# Altium schematic sheet Schematic.SchDoc: Gramo PreAmp
size A4; DrawnBy: M6R3K; Revision: 1A; SheetNumber: 1; SheetTotal: 1
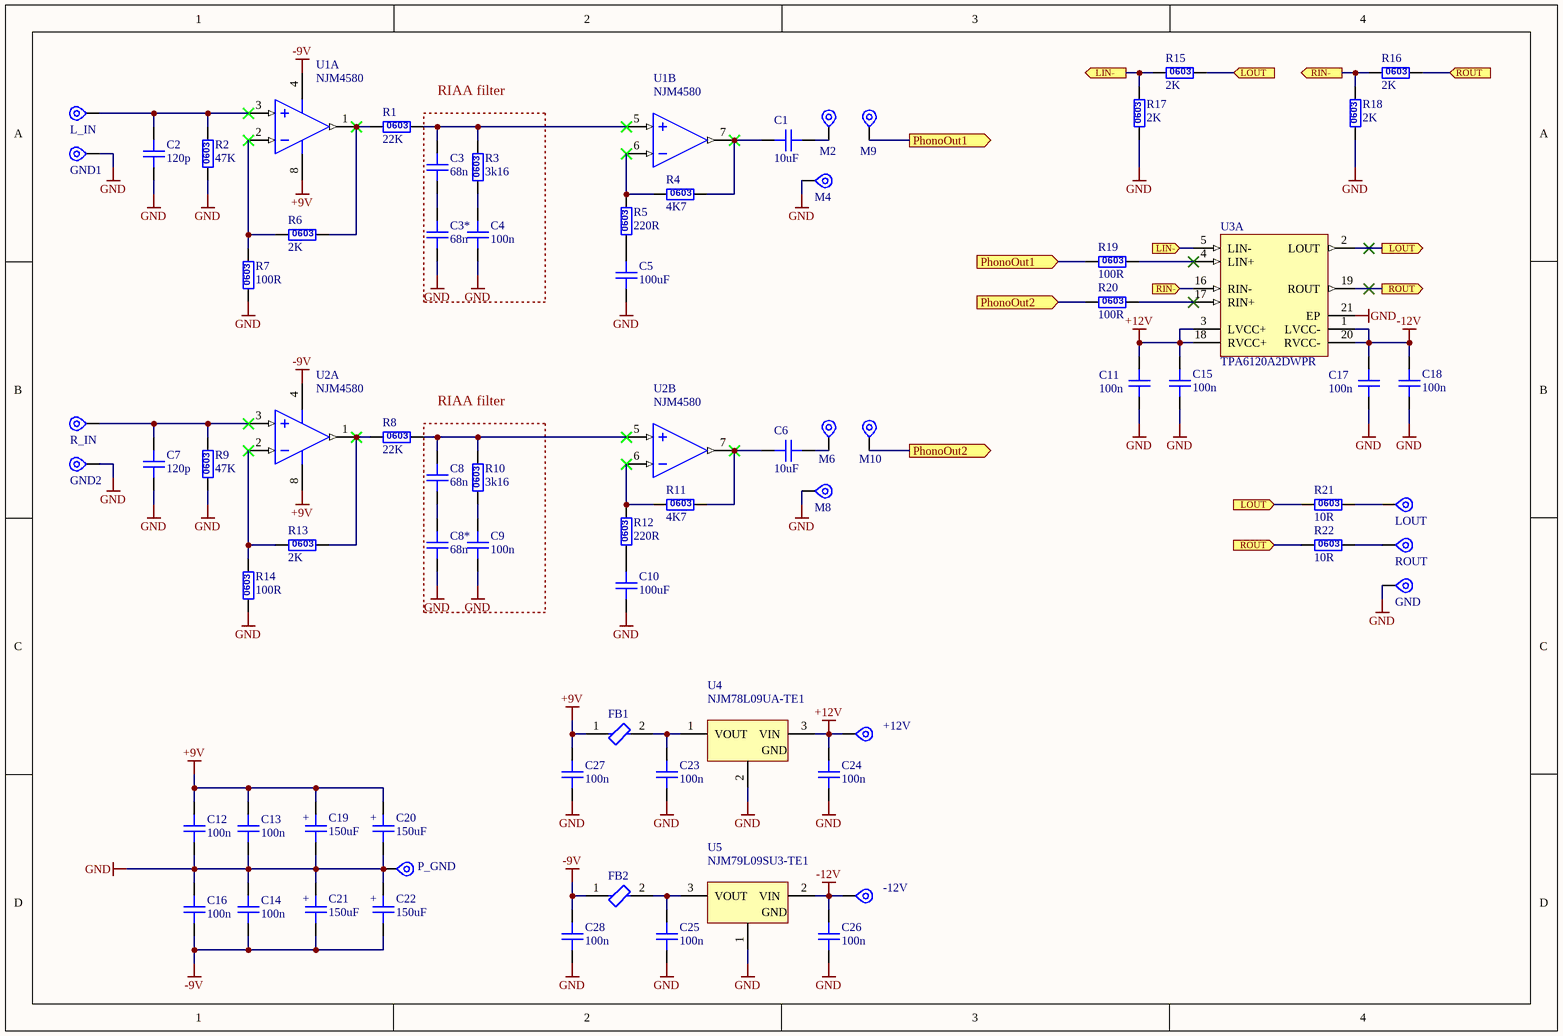
[diagram p0: Schematic.SchDoc]

## Parts
+12V  TP  [Pad 1mm MPoint big]  (value not drawn)  (no BOM)
-12V  TP  [Pad 1mm MPoint big]  (value not drawn)  (no BOM)
C1  10uF  [UES1V]
C2  120p  [C0603]
C3  68n  [VISHAY_MKP]
C3*  68n  [VISHAY_MKP]
C4  100n  [WIMA_MKS_2]
C5  100uF  [UES1E]
C6  10uF  [UES1V]
C7  120p  [C0603]
C8  68n  [VISHAY_MKP]
C8*  68n  [VISHAY_MKP]
C9  100n  [WIMA_MKS_2]
C10  100uF  [UES1E]
C11  100n  [C0603]
C12  100n  [C0603]
C13  100n  [C0603]
C14  100n  [C0603]
C15  100n  [C0603]
C16  100n  [C0603]
C17  100n  [C0603]
C18  100n  [C0603]
C19  150uF  [PZF8x9]
C20  150uF  [PZF8x9]
C21  150uF  [PZF8x9]
C22  150uF  [PZF8x9]
C23  100n  [C0603]
C24  100n  [C0603]
C25  100n  [C0603]
C26  100n  [C0603]
C27  100n  [C0603]
C28  100n  [C0603]
FB1  BLM21AG121SN1D  [FP-BLM21-0_2-t0_85-e0_5-IPC_A]  (value not drawn)
FB2  BLM21AG121SN1D  [FP-BLM21-0_2-t0_85-e0_5-IPC_A]  (value not drawn)
GND  TP  [Pad0.6mm MPoint big]  (value not drawn)  (no BOM)
GND1  TP  [Pad 1mm MPoint big]  (value not drawn)  (no BOM)
GND2  TP  [Pad 1mm MPoint big]  (value not drawn)  (no BOM)
L_IN  TP  [Pad 1mm MPoint big]  (value not drawn)  (no BOM)
LOUT  TP  [Pad0.6mm MPoint big]  (value not drawn)  (no BOM)
M2  TP  [Pad0.6mm MPoint big]  (value not drawn)  (no BOM)
M4  TP  [Pad0.6mm MPoint big]  (value not drawn)  (no BOM)
M6  TP  [Pad0.6mm MPoint big]  (value not drawn)  (no BOM)
M8  TP  [Pad0.6mm MPoint big]  (value not drawn)  (no BOM)
M9  TP  [Pad0.6mm MPoint big]  (value not drawn)  (no BOM)
M10  TP  [Pad0.6mm MPoint big]  (value not drawn)  (no BOM)
P_GND  TP  [Pad 1mm MPoint big]  (value not drawn)  (no BOM)
R1  22K  [R0603]
R2  47K  [R0603]
R3  3k16  [R0603]
R4  4K7  [R0603]
R5  220R  [R0603]
R6  2K  [R0603]
R7  100R  [R0603]
R8  22K  [R0603]
R9  47K  [R0603]
R10  3k16  [R0603]
R11  4K7  [R0603]
R12  220R  [R0603]
R13  2K  [R0603]
R14  100R  [R0603]
R15  2K  [R0603]
R16  2K  [R0603]
R17  2K  [R0603]
R18  2K  [R0603]
R19  100R  [R0603]
R20  100R  [R0603]
R21  10R  [R0603]
R22  10R  [R0603]
R_IN  TP  [Pad 1mm MPoint big]  (value not drawn)  (no BOM)
ROUT  TP  [Pad0.6mm MPoint big]  (value not drawn)  (no BOM)
U1  NJM4580  [PDIP300-P8]  (parts A,B of 2)
U2  NJM4580  [PDIP300-P8]  (parts A,B of 2)
U3  TPA6120A2DWPR  [DWP0020B_N]  (part A of 2)
U4  NJM78L09UA-TE1  [SOT-89_N]
U5  NJM79L09SU3-TE1  [SOT-89_N]

## Blocks framed on the sheet
RIAA filter: C3 C3* C4 R3
RIAA filter: C8 C8* C9 R10

## Ports
LIN- (in), LIN- (out), LOUT (in), LOUT (out), PhonoOut1 (in), PhonoOut1 (out), PhonoOut2 (in), PhonoOut2 (out), RIN- (in), RIN- (out), ROUT (in), ROUT (out)

## Nets
+9V: C12.1 C13.1 C19.1 C20.1 C27.1 FB1.1 U1.8(VDD) U2.8(VDD)
+12V: +12V.1 C11.1 C15.1 C24.1 U3.3(LVCC+) U3.18(RVCC+) U4.3(VIN)
-9V: C14.2 C16.2 C21.2 C22.2 C28.1 FB2.1 U1.4(VSS) U2.4(VSS)
-12V: -12V.1 C17.1 C18.1 C26.1 U3.1(LVCC-) U3.20(RVCC-) U5.2(VIN)
GND: C2.2 C3*.2 C4.2 C5.2 C7.2 C8*.2 C9.2 C10.2 C11.2 C12.2 C13.2 C14.1 C15.2 C16.1 C17.2 C18.2 C19.2 C20.2 C21.1 C22.1 C23.2 C24.2 C25.2 C26.2 C27.2 C28.2 GND.1 GND1.1 GND2.1 M4.1 M8.1 P_GND.1 R2.2 R7.2 R9.2 R14.2 R17.2 R18.2 U3.21(EP) U4.2(GND) U5.1(GND)
LIN-: R15.2 R17.1 U3.5(LIN-) ; port LIN-
LOUT: R15.1 R21.2 U3.2(LOUT) ; port LOUT
PhonoOut1: M9.1 R19.2 ; port PhonoOut1
PhonoOut2: M10.1 R20.2 ; port PhonoOut2
RIN-: R16.2 R18.1 U3.16(RIN-) ; port RIN-
ROUT: R16.1 R22.2 U3.19(ROUT) ; port ROUT
NetC1_1: C1.1 R4.1 U1.7(VOUT2)
NetC1_2: C1.2 M2.1
NetC2_1: C2.1 L_IN.1 R2.1 U1.3(VIN+)
NetC3_1: C3.1 R1.1 R3.1 U1.5(VIN+2)
NetC3_2: C3.2 C3*.1
NetC4_1: C4.1 R3.2
NetC5_1: C5.1 R5.2
NetC6_1: C6.1 R11.1 U2.7(VOUT2)
NetC6_2: C6.2 M6.1
NetC7_1: C7.1 R9.1 R_IN.1 U2.3(VIN+)
NetC8_1: C8.1 R8.1 R10.1 U2.5(VIN+2)
NetC8_2: C8.2 C8*.1
NetC9_1: C9.1 R10.2
NetC10_1: C10.1 R12.2
NetC23_1: C23.1 FB1.2 U4.1(VOUT)
NetC25_1: C25.1 FB2.2 U5.3(VOUT)
NetLOUT_1: LOUT.1 R21.1
NetR1_2: R1.2 R6.1 U1.1(VOUT)
NetR4_2: R4.2 R5.1 U1.6(VIN-2)
NetR6_2: R6.2 R7.1 U1.2(VIN-)
NetR8_2: R8.2 R13.1 U2.1(VOUT)
NetR11_2: R11.2 R12.1 U2.6(VIN-2)
NetR13_2: R13.2 R14.1 U2.2(VIN-)
NetR19_1: R19.1 U3.4(LIN+)
NetR20_1: R20.1 U3.17(RIN+)
NetR22_1: R22.1 ROUT.1

## Notes on the sheet
- (in symbol CR_0603_3K16) 0603
- (in symbol CR_0603_100) 0603
- (in symbol CR_0603_101) 0603
- (in symbol CR_0603_202) 0603
- (in symbol CR_0603_221) 0603
- (in symbol CR_0603_223) 0603
- (in symbol CR_0603_472) 0603
- (in symbol CR_0603_473) 0603
- (in symbol EC_THT_157_polarised) +

## Library data of the parts
+12V -12V GND GND1 GND2 L_IN LOUT M2 M4 M6 M8-M10 P_GND R_IN ROUT = TP_PCB: Test Point; Main: Mechanical; Category: Pads_Pins_Measure_Points; Stock number: --------; Component Type: Mechanical
C1 C6 = EC_THT_106_bipolar: MUSE bipolar capacitor; SMD/THD: THT; Value: 10uF/35V; Main: Capacitors; Category: Capacitors THT; Status: A; Component Type: Capacitors; Supplier 1: Mouser; Supplier 2: Digi-Key; Supplier Part Number 2: 493-10846-1-ND; Supplier Part Number 1: 647-UES1V100MEM1TD
C2 C7 = CC_0603_NP0_121: Ceramic Capacitor NP0; SMD/THD: SMD; Main: Capacitors; Category: Capacitors CERA SMD; Status: A; Value: 120p; ComponentLink1Description: datasheet; Component Type: Capacitors; Supplier 1: Mouser; Supplier 2: Farnell; Supplier Part Number 2: 2581047; Supplier Part Number 1: 80-C0603C121F5G
C3 C3* C8 C8* = FC_THT_683_1%: Foil Capacitor Vishay MKP; SMD/THD: THD; Main: Capacitors; Category: Capacitors THT; Status: A; ComponentLink1Description: datasheet; Component Type: Capacitors; Value: 68n; Supplier 1: Mouser; Supplier 2: Farnell; Supplier Part Number 2: 2528262; Supplier Part Number 1: 75-MKP1837368011
C4 C9 = FC_THT_104: Foil Capacitor WIMA MKS 2; SMD/THD: THD; Main: Capacitors; Category: Capacitors THT; Status: A; ComponentLink1Description: datasheet; Component Type: Capacitors; Supplier 1: Mouser; Supplier Part Number 1: 505-MKS2C031001AJI00; Value: 100n
C5 C10 = EC_THT_107_bipolar: MUSE bipolar capacitor; SMD/THD: THT; Value: 100uF/25V; Main: Capacitors; Category: Capacitors THT; Status: A; Component Type: Capacitors; Supplier 1: Mouser; Supplier 2: Digi-Key; Supplier Part Number 1: 647-UES1E101MPM; Supplier Part Number 2: 493-15025-ND
C11-C18 C23-C28 = CC_0603_X7R_104: Ceramic Capacitor X7R; Part Number: 100n/50V X7R C0603; SMD/THD: SMD; Main: Capacitors; Status: A; Value: 100n; Category: Capacitors CERA SMD; Manufacturer Part Number: 100n/50V X7R C0603; Component Type: Capacitors; Supplier 1: Mouser; Supplier 2: Farnell; Supplier Part Number 1: 581-06035C104K4Z2A; Supplier Part Number 2: 1833843
C19-C22 = EC_THT_157_polarised: High temp hybrid capacitor -55/125C; SMD/THD: THT; Value: 150uF/35V; Main: Capacitors; Category: Capacitors THT; Status: A; Component Type: Capacitors; Supplier 1: Mouser; Supplier 2: Digi-Key; Supplier Part Number 2: 35PZE150M8X9-ND; Supplier Part Number 1: 232-35PZE150M8X9
FB1 FB2 = CMP-0686-00716-3: FERRITE BEAD 120 OHM 0805 1LN; Number of Lines: 1; DC Resistance-Max: 100mR; Material: Steel; Max DC Current: 200mA; Shielding: Unshielded; Test Frequency: 100MHz; Impedance: 120R; Current Rating: 800mA; Max Current Rating: 1A; Resistance: 150mR; Tolerance: 25%; Width: 1.25mm; Number of Circuits: 1; Military Standard: Not; Height: 0.85mm; Series: BLM21A; Min Operating Temperature: -55°C; DC Resistance (DCR): 100mR; Termination: SMD/SMT; Core Material: Ferrite; REACH SVHC: No SVHC; Radiation Hardening: No; Max Operating Temperature: 125°C; Number of Pins: 2; Case/Package: 0805; Case Code (Imperial): 0805; Frequency: 100MHz; Depth: 1.25mm; Length: 2mm; DC Current: 200mA; Lead Free: Lead Free; Case Code (Metric): 2012; Package Quantity: 1; Packaging: Tape and Reel
R1 R8 = CR_0603_223: Resistor 1%, 0.1W, 75V; Part Number: 22K R0603; Manufacturer: Vishay; SMD/THD: SMD; Main: Resistors; Status: A; Category: Resistors SMD; Component Type: Resistors; Supplier 1: TME; Supplier 2: Farnell; Supplier 3: Digi-Key; Value: 22K; Supplier Part Number 1: RC0603JR-0722K; Supplier Part Number 2: 9233547; Supplier Part Number 3: 311-22KGRCT-ND
R2 R9 = CR_0603_473: Resistor 1%, 0.1W, 75V; SMD/THD: SMD; Main: Resistors; Status: A; Category: Resistors SMD; Component Type: Resistors; Supplier 1: Mouser; Supplier 2: Digi-Key; Supplier Part Number 2: YAG2129CT-ND; Supplier Part Number 1: 603-AT0603FRE0747KL; Value: 47K
R3 R10 = CR_0603_3K16: Resistor 1%, 0.1W, 75V; SMD/THD: SMD; Main: Resistors; Status: A; Category: Resistors SMD; Component Type: Resistors; Supplier 1: Mouser; Supplier 2: Digi-Key; Supplier Part Number 2: P20027CT-ND; Supplier Part Number 1: 667-ERJ-PB3B3161V; Value: 3k16
R4 R11 = CR_0603_472: Resistor 1%, 0.1W, 75V; SMD/THD: SMD; Main: Resistors; Status: A; Category: Resistors SMD; Component Type: Resistors; Supplier 1: Mouser; Supplier 2: Farnell; Supplier 3: TME; Supplier Part Number 3: RC0603FR-074K7; Supplier Part Number 2: 9238565; Supplier Part Number 1: 603-RC0603FR-074K7L; Value: 4K7
R5 R12 = CR_0603_221: Resistor 1%, 0.1W, 75V; SMD/THD: SMD; Main: Resistors; Status: A; Category: Resistors SMD; Component Type: Resistors; Supplier 1: Mouser; Supplier 2: TME; Supplier 3: Digi-Key; Supplier Part Number 1: 603-RC0603FR-07220RL; Supplier Part Number 2: RC0603FR-07220R; Supplier Part Number 3: 311-220HRCT-ND; Value: 220R
R6 R13 R15-R18 = CR_0603_202: Resistor 1%, 0.1W, 75V; SMD/THD: SMD; Main: Resistors; Status: A; Category: Resistors SMD; Component Type: Resistors; Supplier 1: Mouser; Supplier 2: Farnell; Supplier 3: TME; Supplier Part Number 1: 603-RC0603FR-072KL; Supplier Part Number 2: 3495801; Supplier Part Number 3: RC0603FR-072K; Value: 2K
R7 R14 R19 R20 = CR_0603_100: Resistor 1%, 0.1W, 75V; SMD/THD: SMD; Main: Resistors; Status: A; Category: Resistors SMD; Component Type: Resistors; Supplier 1: Mouser; Supplier 2: Farnell; Supplier 3: TME; Supplier Part Number 1: 603-RC0603FR-07100RL; Supplier Part Number 2: 9238360; Supplier Part Number 3: RC0603FR-07100R; Value: 100R
R21 R22 = CR_0603_101: Resistor 1%, 0.1W, 75V; SMD/THD: SMD; Main: Resistors; Status: A; Category: Resistors SMD; Component Type: Resistors; Supplier 1: Mouser; Supplier 2: Farnell; Supplier 3: Digi-Key; Supplier Part Number 1: 652-CR0603FX-10R0ELF; Supplier Part Number 2: 2321756; Supplier Part Number 3: CR0603-FX-10R0ELFDKR-ND; Value: 10R
U1 U2 = NJM4580: General Purpose Amplifier; Supplier 1: Mouser; Supplier Part Number 2: 513-NJM4580D
U3 = TPA6120A: High Fidelity Stereo Headphone Amplifier, -40 to 85 degC, 20-pin SOP (DWP20), Green (RoHS & no Sb/Br); Manufacturer: Texas Instruments; Load(Min)(ohms): 16; PSRR(dB): 75; Special Features: Hi-Fi; Supply Min(Min)(Volt): 10; Supply Max(Max)(Volt): 30; Volume Control: Yes; ComponentLink3URL: http://www.ti.com/litv/pdf/mpds032b; ComponentLink2Description: Datasheet; PackageDescription: 20-Pin PowerPAD(TM) Plastic Small-Outline Package, Body 12.825 x 7.52 mm, Pitch 1.27 mm; Mounting Technology: Surface Mount; PackageReference: DWP0020B; DatasheetVersion: SLOS431; Headphone Channels: Stereo; ComponentLink1Description: Manufacturer URL; ComponentLink2URL: http://www.ti.com/general/docs/lit/getliterature.tsp?genericPartNumber=TPA6120A2&fileType=pdf; ComponentLink1URL: http://www.ti.com/; PartNumber: TPA6120A2DWPR; Eco-Plan: Green (RoHS & no Sb/Br); PackageVersion: 4147575/C, 02/2005; ComponentLink3Description: Package Specification; SubFamily: Headphone Amplifier; Supplier 1: Mouser; Supplier 2: Digi-Key; Supplier Part Number 1: 595-TPA6120A2DWPR; Supplier Part Number 2: 296-39339-1-ND
U4 = 7809: Positive Voltage Regulator, 9V, 4-Pin SOT-89, Tape and Reel; Manufacturer: Nisshinbo Micro Devices; Manufacturer Part Number: L78L12ACUTR; DatasheetVersion: 1/02/2011; PackageDescription: 3-Pin SOT-89 Package 1.5 mm Pitch, 4.1 mm Lead Span; ComponentLink2Description: Datasheet; ComponentLink1Description: Manufacturer URL; PackageVersion: 2011; PackageReference: SOT-89; ComponentLink1URL: https://www.nisshinbo-microdevices.co.jp/en/; ComponentLink2URL: https://cz.mouser.com/datasheet/2/294/NJM78L00_E-1917471.pdf
U5 = 7909: Negative Voltage Regulator, -9V, 4-Pin SOT-89, Tape and Reel; Manufacturer: Nisshinbo Micro Devices; Manufacturer Part Number: L79L12ACUTR; ComponentLink1URL: https://www.nisshinbo-microdevices.co.jp/en/; PackageVersion: 2011; PackageReference: SOT-89; ComponentLink2Description: Datasheet; PackageDescription: 3-Pin SOT-89 Package 1.5 mm Pitch, 4.1 mm Lead Span; ComponentLink1Description: Manufacturer URL; DatasheetVersion: 1/07/2009; ComponentLink2URL: https://cz.mouser.com/datasheet/2/294/NJM79L00S_E-1859990.pdf